# Altium project Audio.PrjPCB
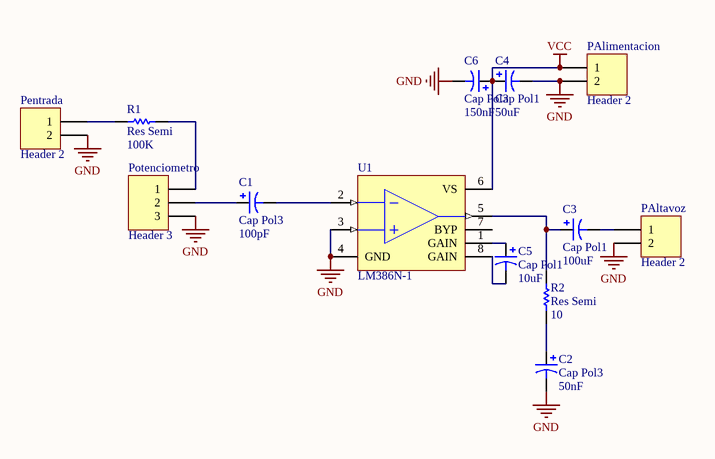
[diagram p0: LM386.SchDoc]
2 sheets, 25 parts. Net scope: global (net labels, ports and power ports of the same name join across sheets).
Board file: LM386_2.PcbDoc
Sheets:
  LM386.SchDoc
  LM386_2.SchDoc

## Sheet LM386.SchDoc
size A4

### Parts
(Parts that share a designator on the sheet are numbered #1, #2 ... from top to bottom, then left to right.)
C1#1  Cap Pol3  value 100pF  [C0805]
C2#1  Cap Pol3  value 50nF  [C0805]
C3#1  Cap Pol1  value 100uF  [HA-C1]
C4#1  Cap Pol1  value 50uF  [HA-C1]
C5#1  Cap Pol1  value 10uF  [HA-C1]
C6#1  Cap Pol3  value 150nF  [C0805]
PAlimentacion#1  Header 2  [HDR1X2]
PAltavoz#1  Header 2  [HDR1X2]
Pentrada#1  Header 2  [HDR1X2]
Potenciometro#1  Header 3  [HDR1X3]
R1  Res Semi  value 100K  [2012[0805]]
R2#1  Res Semi  value 10  [2012[0805]]
U1#1  LM386N-1  [N08E]

### Nets
GND: C2#1.2 C4#1.2 C6#1.2 PAlimentacion#1.2 PAltavoz#1.2 Pentrada#1.2 Potenciometro#1.3 U1#1.3(IN+) U1#1.4(GND)
VCC: C4#1.1 C6#1.1 PAlimentacion#1.1 U1#1.6(VS)
NetC1#1_1: C1#1.1 Potenciometro#1.2
NetC1#1_2: C1#1.2 U1#1.2(IN-)
NetC2#1_1: C2#1.1 R2#1.1
NetC3#1_1: C3#1.1 R2#1.2 U1#1.5(OUT)
NetC3#1_2: C3#1.2 PAltavoz#1.1
NetC5#1_1: C5#1.1 U1#1.1(GAIN)
NetC5#1_2: C5#1.2 U1#1.8(GAIN)
NetPentrada#1_1: Pentrada#1.1 R1.1
NetPotenciometro#1_1: Potenciometro#1.1 R1.2

Not connected (* = marked no-connect by the designer): U1#1 7(BYP)

### Library data of the parts
C1#1 C2#1 C6#1 = Cap Pol3: Polarized Capacitor (Surface Mount); Published: 8-Jun-2000; LatestRevisionDate: 17-Jul-2002; LatestRevisionNote: Re-released for DXP Platform.; PackageReference: C0805; Publisher: Altium Limited
C3#1 C4#1 C5#1 = Cap Pol1: Polarized Capacitor (Radial); Published: 8-Jun-2000; LatestRevisionDate: 17-Jul-2002; LatestRevisionNote: Re-released for DXP Platform.; PackageReference: RB7.6-15; Publisher: Altium Limited
PAlimentacion#1 PAltavoz#1 Pentrada#1 = Header 2: Header, 2-Pin; LatestRevisionDate: 17-Jul-2002; LatestRevisionNote: Re-released for DXP Platform.; Publisher: Altium Limited
Potenciometro#1 = Header 3: Header, 3-Pin; LatestRevisionDate: 17-Jul-2002; LatestRevisionNote: Re-released for DXP Platform.; Publisher: Altium Limited
R1 R2#1 = Res Semi: Semiconductor Resistor; Published: 8-Jun-2000; LatestRevisionDate: 17-Jul-2002; LatestRevisionNote: Re-released for DXP Platform.; PackageReference: AXIAL-0.5; Publisher: Altium Limited
U1#1 = LM386N-1: Low-Voltage Audio Power Amplifier; Published: 15-Apr-2002; LatestRevisionDate: 06-Jun-2005; LatestRevisionNote: Stylized 3D Model Added.; DatasheetDocument: Sep-1997; PackageDocument: Sep-1997; PackageReference: N08E; Publisher: Altium Limited; ComponentLink1Description: Manufacturer Link; ComponentLink1URL: http://www.national.com/; ComponentLink2Description: Datasheet; ComponentLink2URL: http://www.national.com/ds.cgi/LM/LM386.pdf; ComponentLink3Description: URL Link1; ComponentLink3URL: http://www.national.com/pf/LM/LM386.html

## Sheet LM386_2.SchDoc
size A4
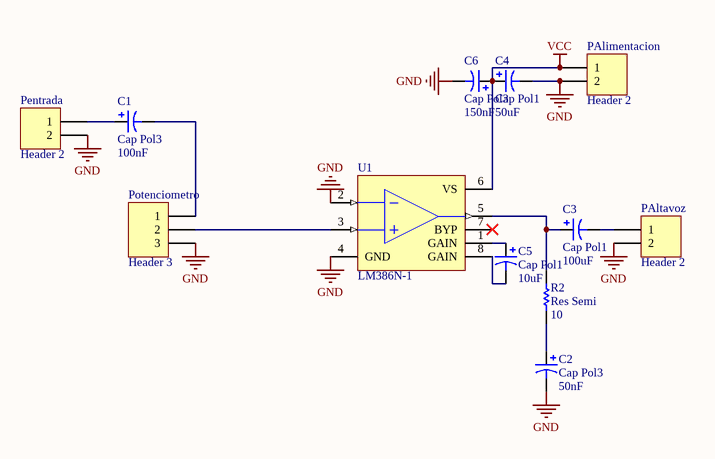
[diagram p1: LM386_2.SchDoc]

### Parts
(Parts that share a designator on the sheet are numbered #1, #2 ... from top to bottom, then left to right.)
C1#2  Cap Pol3  value 100nF  [C0805]
C2#2  Cap Pol3  value 50nF  [C0805]
C3#2  Cap Pol1  value 100uF  [B]
C4#2  Cap Pol1  value 50uF  [B]
C5#2  Cap Pol1  value 10uF  [B]
C6#2  Cap Pol3  value 150nF  [C0805]
PAlimentacion#2  Header 2  [HDR1X2]
PAltavoz#2  Header 2  [HDR1X2]
Pentrada#2  Header 2  [HDR1X2]
Potenciometro#2  Header 3  [HDR1X3]
R2#2  Res Semi  value 10  [2012[0805]]
U1#2  LM386N-1  [N08E]

### Nets
GND: C2#2.2 C4#2.2 C6#2.2 PAlimentacion#2.2 PAltavoz#2.2 Pentrada#2.2 Potenciometro#2.3 U1#2.2(IN-) U1#2.4(GND)
VCC: C4#2.1 C6#2.1 PAlimentacion#2.1 U1#2.6(VS)
NetC1#2_1: C1#2.1 Pentrada#2.1
NetC1#2_2: C1#2.2 Potenciometro#2.1
NetC2#2_1: C2#2.1 R2#2.1
NetC3#2_1: C3#2.1 R2#2.2 U1#2.5(OUT)
NetC3#2_2: C3#2.2 PAltavoz#2.1
NetC5#2_1: C5#2.1 U1#2.1(GAIN)
NetC5#2_2: C5#2.2 U1#2.8(GAIN)
NetPotenciometro#2_2: Potenciometro#2.2 U1#2.3(IN+)

Not connected (* = marked no-connect by the designer): U1#2 7(BYP)*

### Library data of the parts
C1#2 C2#2 C6#2 = Cap Pol3: Polarized Capacitor (Surface Mount); Published: 8-Jun-2000; LatestRevisionDate: 17-Jul-2002; LatestRevisionNote: Re-released for DXP Platform.; PackageReference: C0805; Publisher: Altium Limited
C3#2 C4#2 C5#2 = Cap Pol1: Polarized Capacitor (Radial); Published: 8-Jun-2000; LatestRevisionDate: 17-Jul-2002; LatestRevisionNote: Re-released for DXP Platform.; PackageReference: RB7.6-15; Publisher: Altium Limited
PAlimentacion#2 PAltavoz#2 Pentrada#2 = Header 2: Header, 2-Pin; LatestRevisionDate: 17-Jul-2002; LatestRevisionNote: Re-released for DXP Platform.; Publisher: Altium Limited
Potenciometro#2 = Header 3: Header, 3-Pin; LatestRevisionDate: 17-Jul-2002; LatestRevisionNote: Re-released for DXP Platform.; Publisher: Altium Limited
R2#2 = Res Semi: Semiconductor Resistor; Published: 8-Jun-2000; LatestRevisionDate: 17-Jul-2002; LatestRevisionNote: Re-released for DXP Platform.; PackageReference: AXIAL-0.5; Publisher: Altium Limited
U1#2 = LM386N-1: Low-Voltage Audio Power Amplifier; Published: 15-Apr-2002; LatestRevisionDate: 06-Jun-2005; LatestRevisionNote: Stylized 3D Model Added.; DatasheetDocument: Sep-1997; PackageDocument: Sep-1997; PackageReference: N08E; Publisher: Altium Limited; ComponentLink1Description: Manufacturer Link; ComponentLink1URL: http://www.national.com/; ComponentLink2Description: Datasheet; ComponentLink2URL: http://www.national.com/ds.cgi/LM/LM386.pdf; ComponentLink3Description: URL Link1; ComponentLink3URL: http://www.national.com/pf/LM/LM386.html

## Nets that join several sheets
GND: LM386 (9 pins), LM386_2 (9 pins)
VCC: LM386 (C4#1.1 C6#1.1 PAlimentacion#1.1 U1#1.6), LM386_2 (C4#2.1 C6#2.1 PAlimentacion#2.1 U1#2.6)